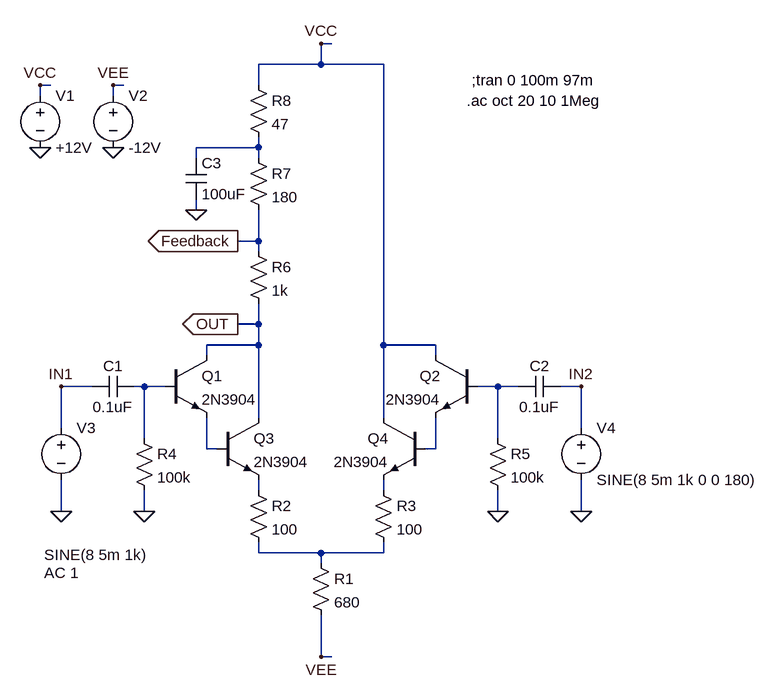
[diagram p0: schematic Analog2.0_DiffAmp_Darington_AvLimit.asc]
Analog2.0_DiffAmp_Darington_AvLimit.asc, the LTspice schematic file:
Version 4
SHEET 1 1520 680
WIRE 832 -576 816 -576
WIRE 816 -544 816 -576
WIRE 816 -544 720 -544
WIRE 912 -544 816 -544
WIRE 400 -512 384 -512
WIRE 512 -512 496 -512
WIRE 720 -512 720 -544
WIRE 384 -496 384 -512
WIRE 496 -496 496 -512
WIRE 720 -416 720 -432
WIRE 720 -416 624 -416
WIRE 624 -400 624 -416
WIRE 720 -400 720 -416
WIRE 624 -320 624 -336
WIRE 720 -272 720 -320
WIRE 720 -272 688 -272
WIRE 720 -256 720 -272
WIRE 720 -144 720 -176
WIRE 720 -144 688 -144
WIRE 720 -112 720 -144
WIRE 720 -112 640 -112
WIRE 912 -112 912 -544
WIRE 992 -112 912 -112
WIRE 640 -96 640 -112
WIRE 992 -96 992 -112
WIRE 464 -48 416 -48
WIRE 544 -48 528 -48
WIRE 576 -48 544 -48
WIRE 1088 -48 1056 -48
WIRE 1120 -48 1088 -48
WIRE 1216 -48 1184 -48
WIRE 720 0 720 -112
WIRE 912 0 912 -112
WIRE 416 16 416 -48
WIRE 1216 16 1216 -48
WIRE 544 32 544 -48
WIRE 1088 32 1088 -48
WIRE 640 48 640 0
WIRE 656 48 640 48
WIRE 992 48 992 0
WIRE 992 48 976 48
WIRE 720 112 720 96
WIRE 912 112 912 96
WIRE 416 144 416 96
WIRE 544 144 544 112
WIRE 1088 144 1088 112
WIRE 1216 144 1216 96
WIRE 720 208 720 192
WIRE 816 208 720 208
WIRE 912 208 912 192
WIRE 912 208 816 208
WIRE 816 224 816 208
WIRE 816 368 816 304
WIRE 832 368 816 368
FLAG 384 -416 0
FLAG 496 -416 0
FLAG 384 -512 VCC
FLAG 496 -512 VEE
FLAG 816 368 VEE
FLAG 544 144 0
FLAG 1088 144 0
FLAG 624 -320 0
FLAG 688 -144 OUT
IOPIN 688 -144 Out
FLAG 688 -272 Feedback
IOPIN 688 -272 Out
FLAG 816 -576 VCC
FLAG 416 144 0
FLAG 1216 144 0
FLAG 416 -48 IN1
FLAG 1216 -48 IN2
SYMBOL voltage 384 -512 R0
WINDOW 123 0 0 Left 2
WINDOW 39 0 0 Left 2
SYMATTR InstName V1
SYMATTR Value +12V
SYMBOL voltage 496 -512 R0
WINDOW 123 0 0 Left 2
WINDOW 39 0 0 Left 2
SYMATTR InstName V2
SYMATTR Value -12V
SYMBOL cap 528 -64 R90
WINDOW 0 0 32 VBottom 2
WINDOW 3 32 32 VTop 2
SYMATTR InstName C1
SYMATTR Value 0.1uF
SYMBOL cap 1184 -64 R90
WINDOW 0 0 32 VBottom 2
WINDOW 3 32 32 VTop 2
SYMATTR InstName C2
SYMATTR Value 0.1uF
SYMBOL npn 576 -96 R0
SYMATTR InstName Q1
SYMATTR Value 2N3904
SYMBOL npn 1056 -96 M0
SYMATTR InstName Q2
SYMATTR Value 2N3904
SYMBOL npn 656 0 R0
SYMATTR InstName Q3
SYMATTR Value 2N3904
SYMBOL npn 976 0 M0
SYMATTR InstName Q4
SYMATTR Value 2N3904
SYMBOL res 800 208 R0
SYMATTR InstName R1
SYMATTR Value 680
SYMBOL res 528 16 R0
SYMATTR InstName R4
SYMATTR Value 100k
SYMBOL res 1072 16 R0
SYMATTR InstName R5
SYMATTR Value 100k
SYMBOL res 704 -272 R0
SYMATTR InstName R6
SYMATTR Value 1k
SYMBOL res 704 -416 R0
SYMATTR InstName R7
SYMATTR Value 180
SYMBOL res 704 -528 R0
SYMATTR InstName R8
SYMATTR Value 47
SYMBOL cap 608 -400 R0
SYMATTR InstName C3
SYMATTR Value 100uF
SYMBOL voltage 416 0 R0
WINDOW 3 -26 211 Left 2
WINDOW 123 -26 239 Left 2
WINDOW 39 0 0 Left 2
SYMATTR Value SINE(8 5m 1k)
SYMATTR Value2 AC 1
SYMATTR InstName V3
SYMBOL voltage 1216 0 R0
WINDOW 123 0 0 Left 2
WINDOW 39 0 0 Left 2
SYMATTR InstName V4
SYMATTR Value SINE(8 5m 1k 0 0 180)
SYMBOL res 704 96 R0
SYMATTR InstName R2
SYMATTR Value 100
SYMBOL res 896 96 R0
SYMATTR InstName R3
SYMATTR Value 100
TEXT 1048 -520 Left 2 !;tran 0 100m 97m
TEXT 1040 -488 Left 2 !.ac oct 20 10 1Meg

The netlist it stands for:
* Analog2.0_DiffAmp_Darington_AvLimit.asc
V1 VCC 0 +12V
V2 VEE 0 -12V
C1 N002 IN1 0.1uF
C2 IN2 N003 0.1uF
Q1 OUT N002 N004 0 2N3904
Q2 VCC N003 N005 0 2N3904
Q3 OUT N004 N006 0 2N3904
Q4 VCC N005 N007 0 2N3904
R1 N008 VEE 680
R4 N002 0 100k
R5 N003 0 100k
R6 Feedback OUT 1k
R7 N001 Feedback 180
R8 VCC N001 47
C3 N001 0 100uF
V3 IN1 0 SINE(8 5m 1k) AC 1
V4 IN2 0 SINE(8 5m 1k 0 0 180)
R2 N006 N008 100
R3 N007 N008 100
.model NPN NPN
.model PNP PNP
.lib standard.bjt
;tran 0 100m 97m
.ac oct 20 10 1Meg
.backanno
.end